# Altium schematic sheet Controller_Board_Interface.SchDoc: IMU Controller Board Interface
size Letter; DocumentNumber: 1; Revision: 1.3; SheetNumber: 1; SheetTotal: 2; Website: www.uwmidsun.com
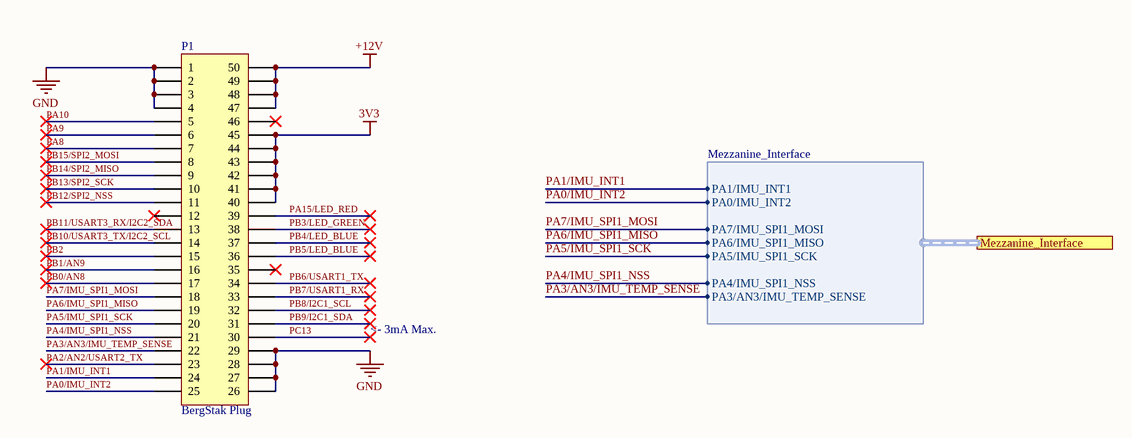
[diagram p0: Controller_Board_Interface.SchDoc]

## Parts
P1  Series: BergStak Plug  [CONN, Bergstak 50 Pos Plug]  (hidden comment: CONN 50POS Bergstak Plug 0.02")

## Ports
Mezzanine_Interface (harness Mezzanine_Interface)

## Harnesses
Mezzanine_Interface: PA1/IMU_INT1, PA0/IMU_INT2, PA7/IMU_SPI1_MOSI, PA6/IMU_SPI1_MISO, PA5/IMU_SPI1_SCK, PA4/IMU_SPI1_NSS, PA3/AN3/IMU_TEMP_SENSE

## Nets
3V3: P1.40 P1.41 P1.42 P1.43 P1.44 P1.45
+12V: P1.47 P1.48 P1.49 P1.50
GND: P1.1 P1.2 P1.3 P1.4 P1.26 P1.27 P1.28 P1.29
PA0/IMU_INT2: P1.25 ; port Mezzanine_Interface.PA0/IMU_INT2
PA1/IMU_INT1: P1.24 ; port Mezzanine_Interface.PA1/IMU_INT1
PA2/AN2/USART2_TX: P1.23
PA3/AN3/IMU_TEMP_SENSE: P1.22 ; port Mezzanine_Interface.PA3/AN3/IMU_TEMP_SENSE
PA4/IMU_SPI1_NSS: P1.21 ; port Mezzanine_Interface.PA4/IMU_SPI1_NSS
PA5/IMU_SPI1_SCK: P1.20 ; port Mezzanine_Interface.PA5/IMU_SPI1_SCK
PA6/IMU_SPI1_MISO: P1.19 ; port Mezzanine_Interface.PA6/IMU_SPI1_MISO
PA7/IMU_SPI1_MOSI: P1.18 ; port Mezzanine_Interface.PA7/IMU_SPI1_MOSI
PA8: P1.7
PA9: P1.6
PA10: P1.5
PA15/LED_RED: P1.39
PB0/AN8: P1.17
PB1/AN9: P1.16
PB2: P1.15
PB3/LED_GREEN: P1.38
PB4/LED_BLUE: P1.37
PB5/LED_BLUE: P1.36
PB6/USART1_TX: P1.34
PB7/USART1_RX: P1.33
PB8/I2C1_SCL: P1.32
PB9/I2C1_SDA: P1.31
PB10/USART3_TX/I2C2_SCL: P1.14
PB11/USART3_RX/I2C2_SDA: P1.13
PB12/SPI2_NSS: P1.11
PB13/SPI2_SCK: P1.10
PB14/SPI2_MISO: P1.9
PB15/SPI2_MOSI: P1.8
PC13: P1.30

Not connected (* = marked no-connect by the designer): P1 12* 35* 46*

## Notes on the sheet
- <- 3mA Max.
- Project:
- Title:
- Size:
- Project Lead:
- Letter
- Revision:
- University of Waterloo
- 200 University Ave W
- Waterloo, ON, Canada
- N2L 3E9
- Date:
- Sheet
- of
- Website:

## Library data of the parts
P1 = CONN 50POS Bergstak Plug 0.02": 50 Position Connector Plug, Outer Shroud Contacts Surface Mount Gold; Manufacturer 1: Amphenol FCI; Manufacturer Part Number 1: 10132797-055100LF; Number of Positions: 50; Mated Stacking Heights: 5mm; Pitch: 0.020" (0.50mm); Supplier 1: Digi-Key; Supplier Part Number 1: 609-5226-1-ND; Packaging: Cut Tape (CT); Part Status: Active; Connector Type: Plug, Outer Shroud Contacts; Number of Rows: 2; Mounting Type: Surface Mount; Contact Finish: Gold; Contact Finish Thickness: 1µin (0.025µm); Height Above Board: 0.169" (4.30mm); ComponentLink1URL: http://portal.fciconnect.com/Comergent//fci/drawing/10132797.pdf; ComponentLink1Description: http://portal.fciconnect.com/Comergent//fci/drawing/10132797.pdf